# Altium schematic sheet Sheet1.SchDoc
size A3
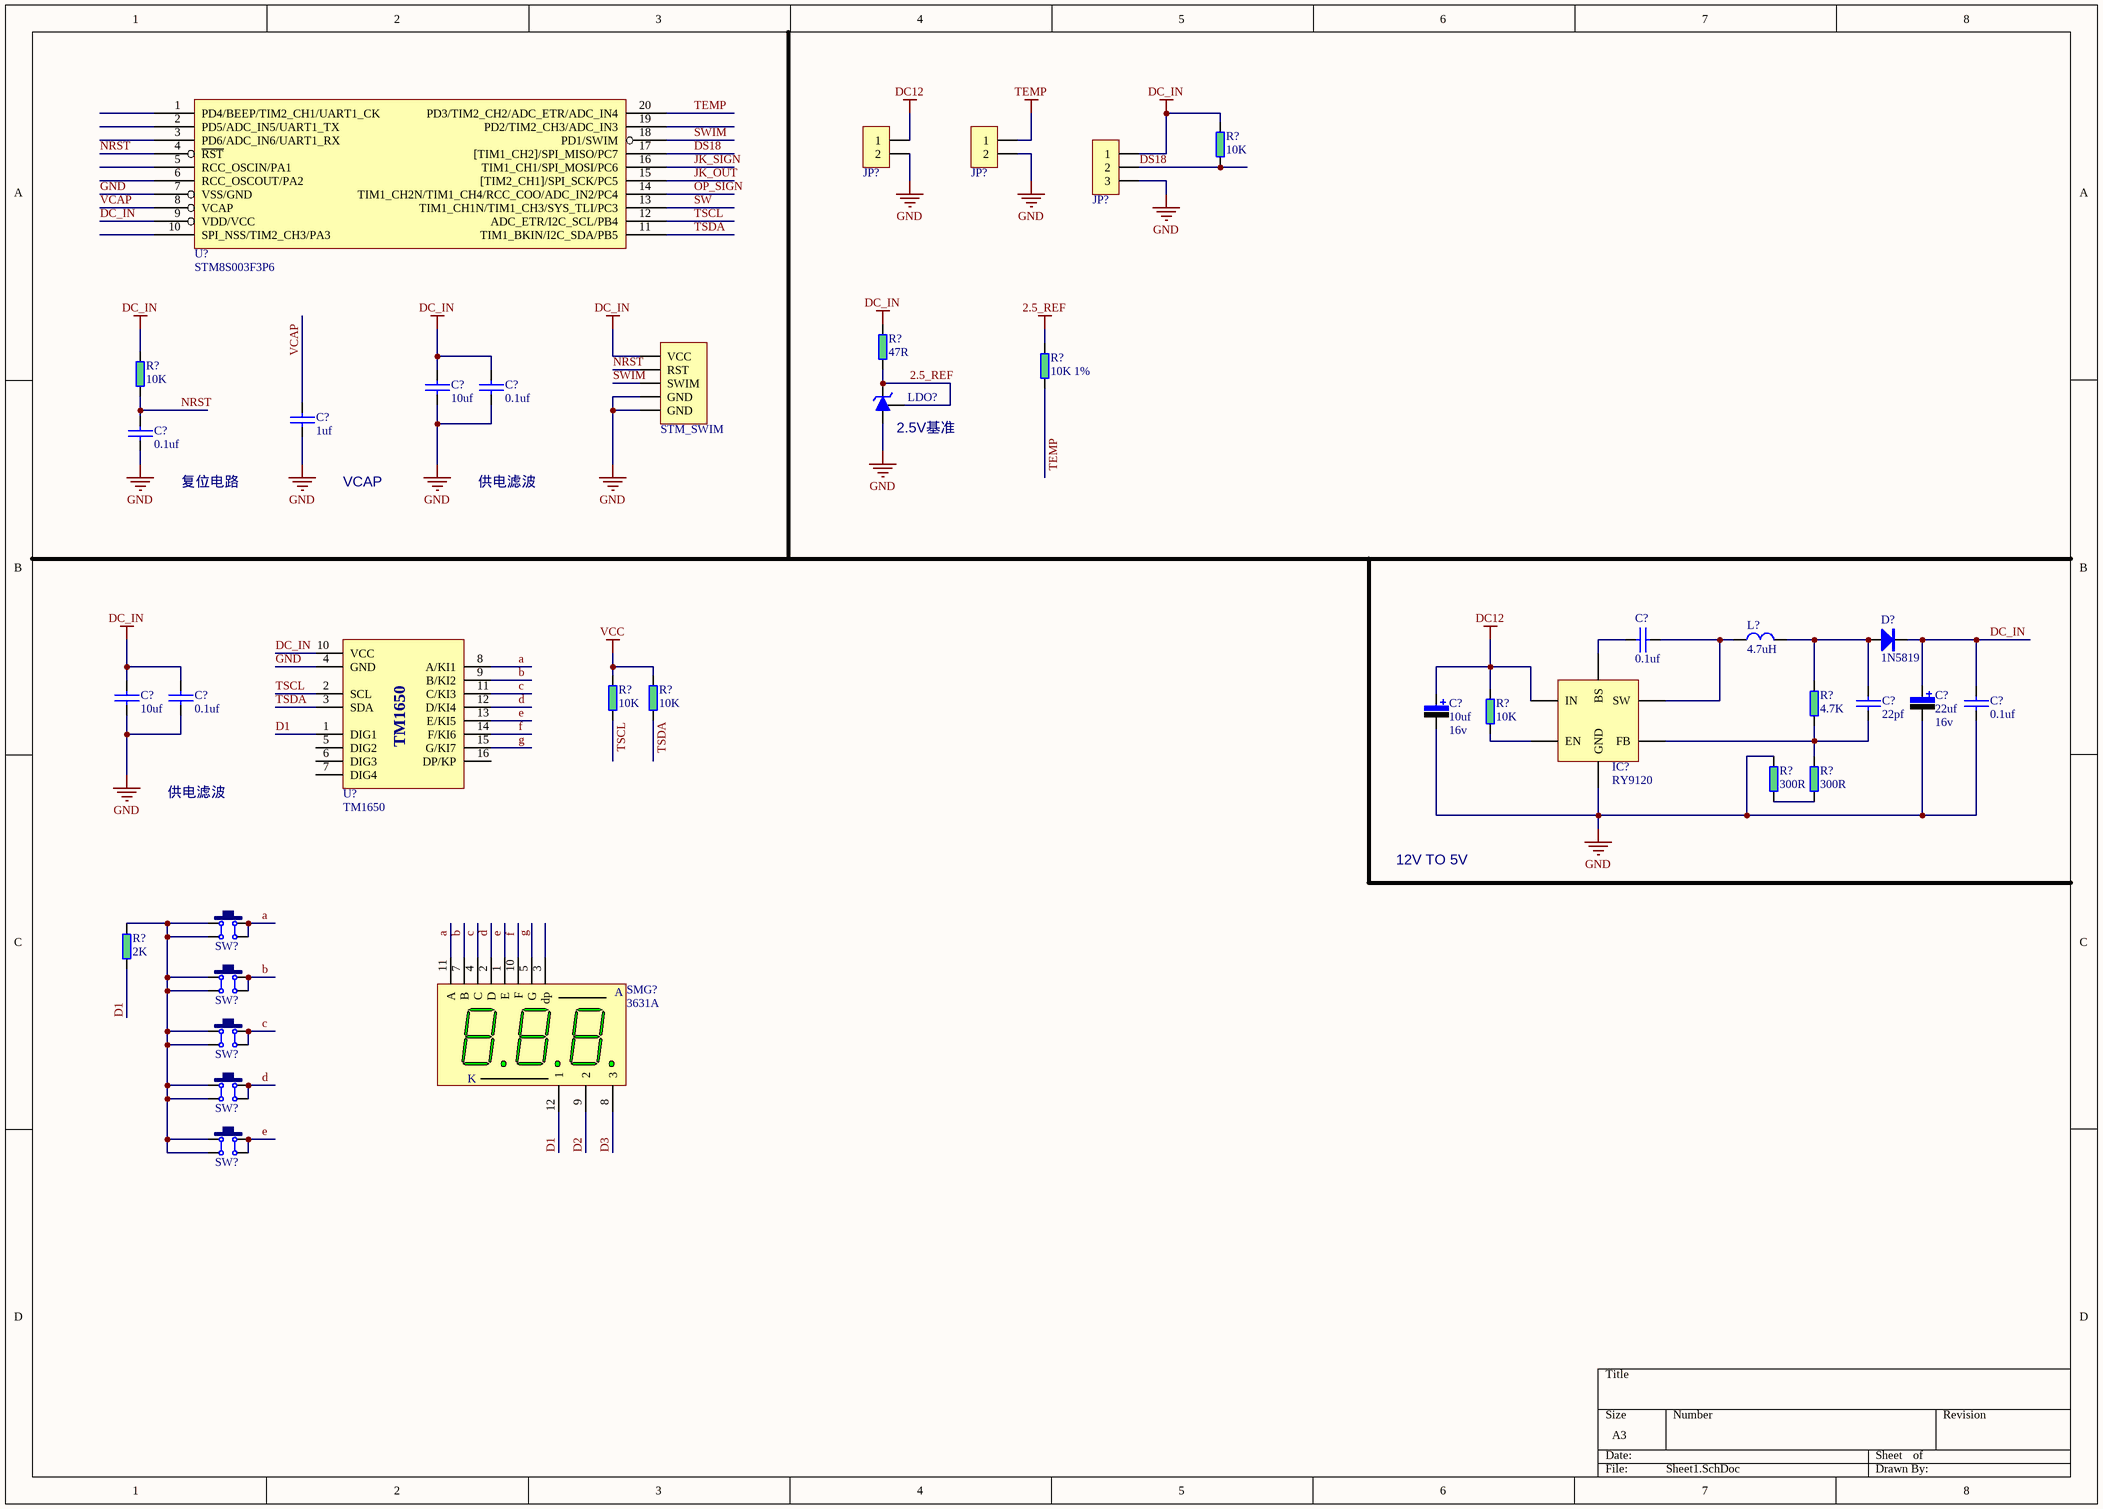
[diagram p0: Sheet1.SchDoc]

## Parts
(Parts that share a designator on the sheet are numbered #1, #2 ... from top to bottom, then left to right.)
C?#1  value 10uf  [C 0603]  (hidden comment: 04.Cap)
C?#2  value 0.1uf  [C 0603]  (hidden comment: 04.Cap)
C?#3  value 1uf  [C 0603]  (hidden comment: 04.Cap)
C?#4  value 0.1uf  [C 0603]  (hidden comment: 04.Cap)
C?#5  value 0.1uf  [C 0603]  (hidden comment: 04.Cap)
C?#6  value 10uf  [C 0603]  (hidden comment: 04.Cap)
C?#7  value 0.1uf  [C 0603]  (hidden comment: 04.Cap)
C?#8  value 0.1uf  [C MLCC5.08]  (hidden comment: 04.Cap)
C?#9  value 22pf  [C 0603]  (hidden comment: 04.Cap)
C?#10  value 22uf  value 16v  [CAP 25v22uf（4*8）]  (hidden comment: 05.Cap-EC)
C?#11  value 10uf  value 16v  [CAP 25v22uf（4*8）]  (hidden comment: 05.Cap-EC)
D?  1N5819  [D 1N5819W-SOD123]
IC?  RY9120  [SOT23-6L]
JP?#1  Pin02  [XH2.54 2P]  (value not drawn)
JP?#2  Pin02  [XH2.54 2P]  (value not drawn)
JP?#3  Pin03  [XH2.54 3P]  (value not drawn)
L?  4.7uH  [L CD54]
LDO?  TL431  [P TL431-TO92A]  (value not drawn)
R?#1  10K  [R 0603]
R?#2  47R  [RS 1/4W-V3]
R?#3  10K 1%  [R 0805]
R?#4  10K  [R 0603]
R?#5  10K  [R 0603]
R?#6  10K  [R 0603]
R?#7  4.7K  [R 0603]
R?#8  10K  [R 0603]
R?#9  300R  [R 0603]
R?#10  300R  [R 0603]
R?#11  2K  [R 0603]
SMG?  3631A  [SMG 0.36-3P]
STM_SWIM  WR_STM-SWIM  [MCU_WRITE]  (value not drawn)
SW?#1  TSW DIP-6x6  [TSW DIP-6*6]  (value not drawn)
SW?#2  TSW DIP-6x6  [TSW DIP-6*6]  (value not drawn)
SW?#3  TSW DIP-6x6  [TSW DIP-6*6]  (value not drawn)
SW?#4  TSW DIP-6x6  [TSW DIP-6*6]  (value not drawn)
SW?#5  TSW DIP-6x6  [TSW DIP-6*6]  (value not drawn)
U?#1  STM8S003F3P6  [TSSOP20]
U?#2  TM1650  [SOP16]

## Nets
2.5_REF: LDO?.K LDO?.R R?#2.1 R?#3.2
DC12: C?#11.1 IC?.5(IN) JP?#1.1 R?#8.2
DC_IN: C?#1.1 C?#2.1 C?#6.1 C?#7.1 C?#8.1 C?#10.1 D?.K JP?#3.1 R?#1.2 R?#2.2 R?#4.2 STM_SWIM.1(VCC) U?#1.9(VDD/VCC) U?#2.10(VCC)
GND: C?#1.2 C?#2.2 C?#3.2 C?#4.2 C?#6.2 C?#7.2 C?#8.2 C?#10.2 C?#11.2 IC?.2(GND) JP?#1.2 JP?#2.2 JP?#3.3 LDO?.A R?#9.2 STM_SWIM.4(GND) STM_SWIM.5(GND) U?#1.7(VSS/GND) U?#2.4(GND)
TEMP: JP?#2.1 R?#3.1 U?#1.20(PD3/TIM2_CH2/ADC_ETR/ADC_IN4)
VCC: R?#5.2 R?#6.2
a: SMG?.11(A) SW?#1.C SW?#1.D U?#2.8(A/KI1)
b: SMG?.7(B) SW?#2.C SW?#2.D U?#2.9(B/KI2)
c: SMG?.4(C) SW?#3.C SW?#3.D U?#2.11(C/KI3)
d: SMG?.2(D) SW?#4.C SW?#4.D U?#2.12(D/KI4)
D1: R?#11.1 SMG?.12(1) U?#2.1(DIG1)
D2: SMG?.9(2)
D3: SMG?.8(3)
DS18: JP?#3.2 R?#1.1 U?#1.17([TIM1_CH2]/SPI_MISO/PC7)
e: SMG?.1(E) SW?#5.C SW?#5.D U?#2.13(E/KI5)
f: SMG?.10(F) U?#2.14(F/KI6)
g: SMG?.5(G) U?#2.15(G/KI7)
JK_OUT: U?#1.15([TIM2_CH1]/SPI_SCK/PC5)
JK_SIGN: U?#1.16(TIM1_CH1/SPI_MOSI/PC6)
NRST: C?#4.1 R?#4.1 STM_SWIM.2(RST) U?#1.4(~{RST})
OP_SIGN: U?#1.14(TIM1_CH2N/TIM1_CH4/RCC_COO/ADC_IN2/PC4)
SW: U?#1.13(TIM1_CH1N/TIM1_CH3/SYS_TLI/PC3)
SWIM: STM_SWIM.3(SWIM) U?#1.18(PD1/SWIM)
TSCL: R?#5.1 U?#1.12(ADC_ETR/I2C_SCL/PB4) U?#2.2(SCL)
TSDA: R?#6.1 U?#1.11(TIM1_BKIN/I2C_SDA/PB5) U?#2.3(SDA)
VCAP: C?#3.1 U?#1.8(VCAP)
NetC?#5_1: C?#5.1 IC?.1(BS)
NetC?#5_2: C?#5.2 IC?.6(SW) L?.1
NetC?#9_1: C?#9.1 IC?.3(FB) R?#7.1 R?#10.2
NetC?#9_2: C?#9.2 D?.A L?.2 R?#7.2
NetIC?_4: IC?.4(EN) R?#8.1
NetR?#9_1: R?#9.1 R?#10.1
NetR?#11_2: R?#11.2 SW?#1.A SW?#1.B SW?#2.A SW?#2.B SW?#3.A SW?#3.B SW?#4.A SW?#4.B SW?#5.A SW?#5.B

Not connected (* = marked no-connect by the designer): SMG? 3(dp); U?#1 1(PD4/BEEP/TIM2_CH1/UART1_CK) 2(PD5/ADC_IN5/UART1_TX) 3(PD6/ADC_IN6/UART1_RX) 5(RCC_OSCIN/PA1) 6(RCC_OSCOUT/PA2) 10(SPI_NSS/TIM2_CH3/PA3) 19(PD2/TIM2_CH3/ADC_IN3); U?#2 5(DIG2) 6(DIG3) 7(DIG4) 16(DP/KP)

## Notes on the sheet
- (near LDO?) 2.5V基准
- (near C?#4) 复位电路
- VCAP
- 供电滤波
- 12V TO 5V
- (in symbol 3631A) K

## Library data of the parts
C?#1-C?#9 = 04.Cap: 电容
C?#10 C?#11 = 05.Cap-EC: 电解电容
D? = 12.Diode: 二极管
L? = 06.Ind: 电感
LDO? = TL431: 电压基准（out=Ref*(1+R1/R2)）
R?#1-R?#11 = 01.Res: 电阻
SMG? = 3631A: 0.36寸3位共阴数码管; 版权归属: 源创客; BOM名称: 0.36寸3位共阴; 学习资源: www.ooocke.com
SW?#1-SW?#5 = TSW DIP-6x6: 6x6轻触开关; BOM名称: 6x6轻触开关
U?#2 = TM1650: 数码管驱动芯片